# EasyEDA Pro project ProPrj_24v转5v_2024-09-12.epro

# Schematic Schematic1
Board Name: Board1; Create Date: 2024-09-04
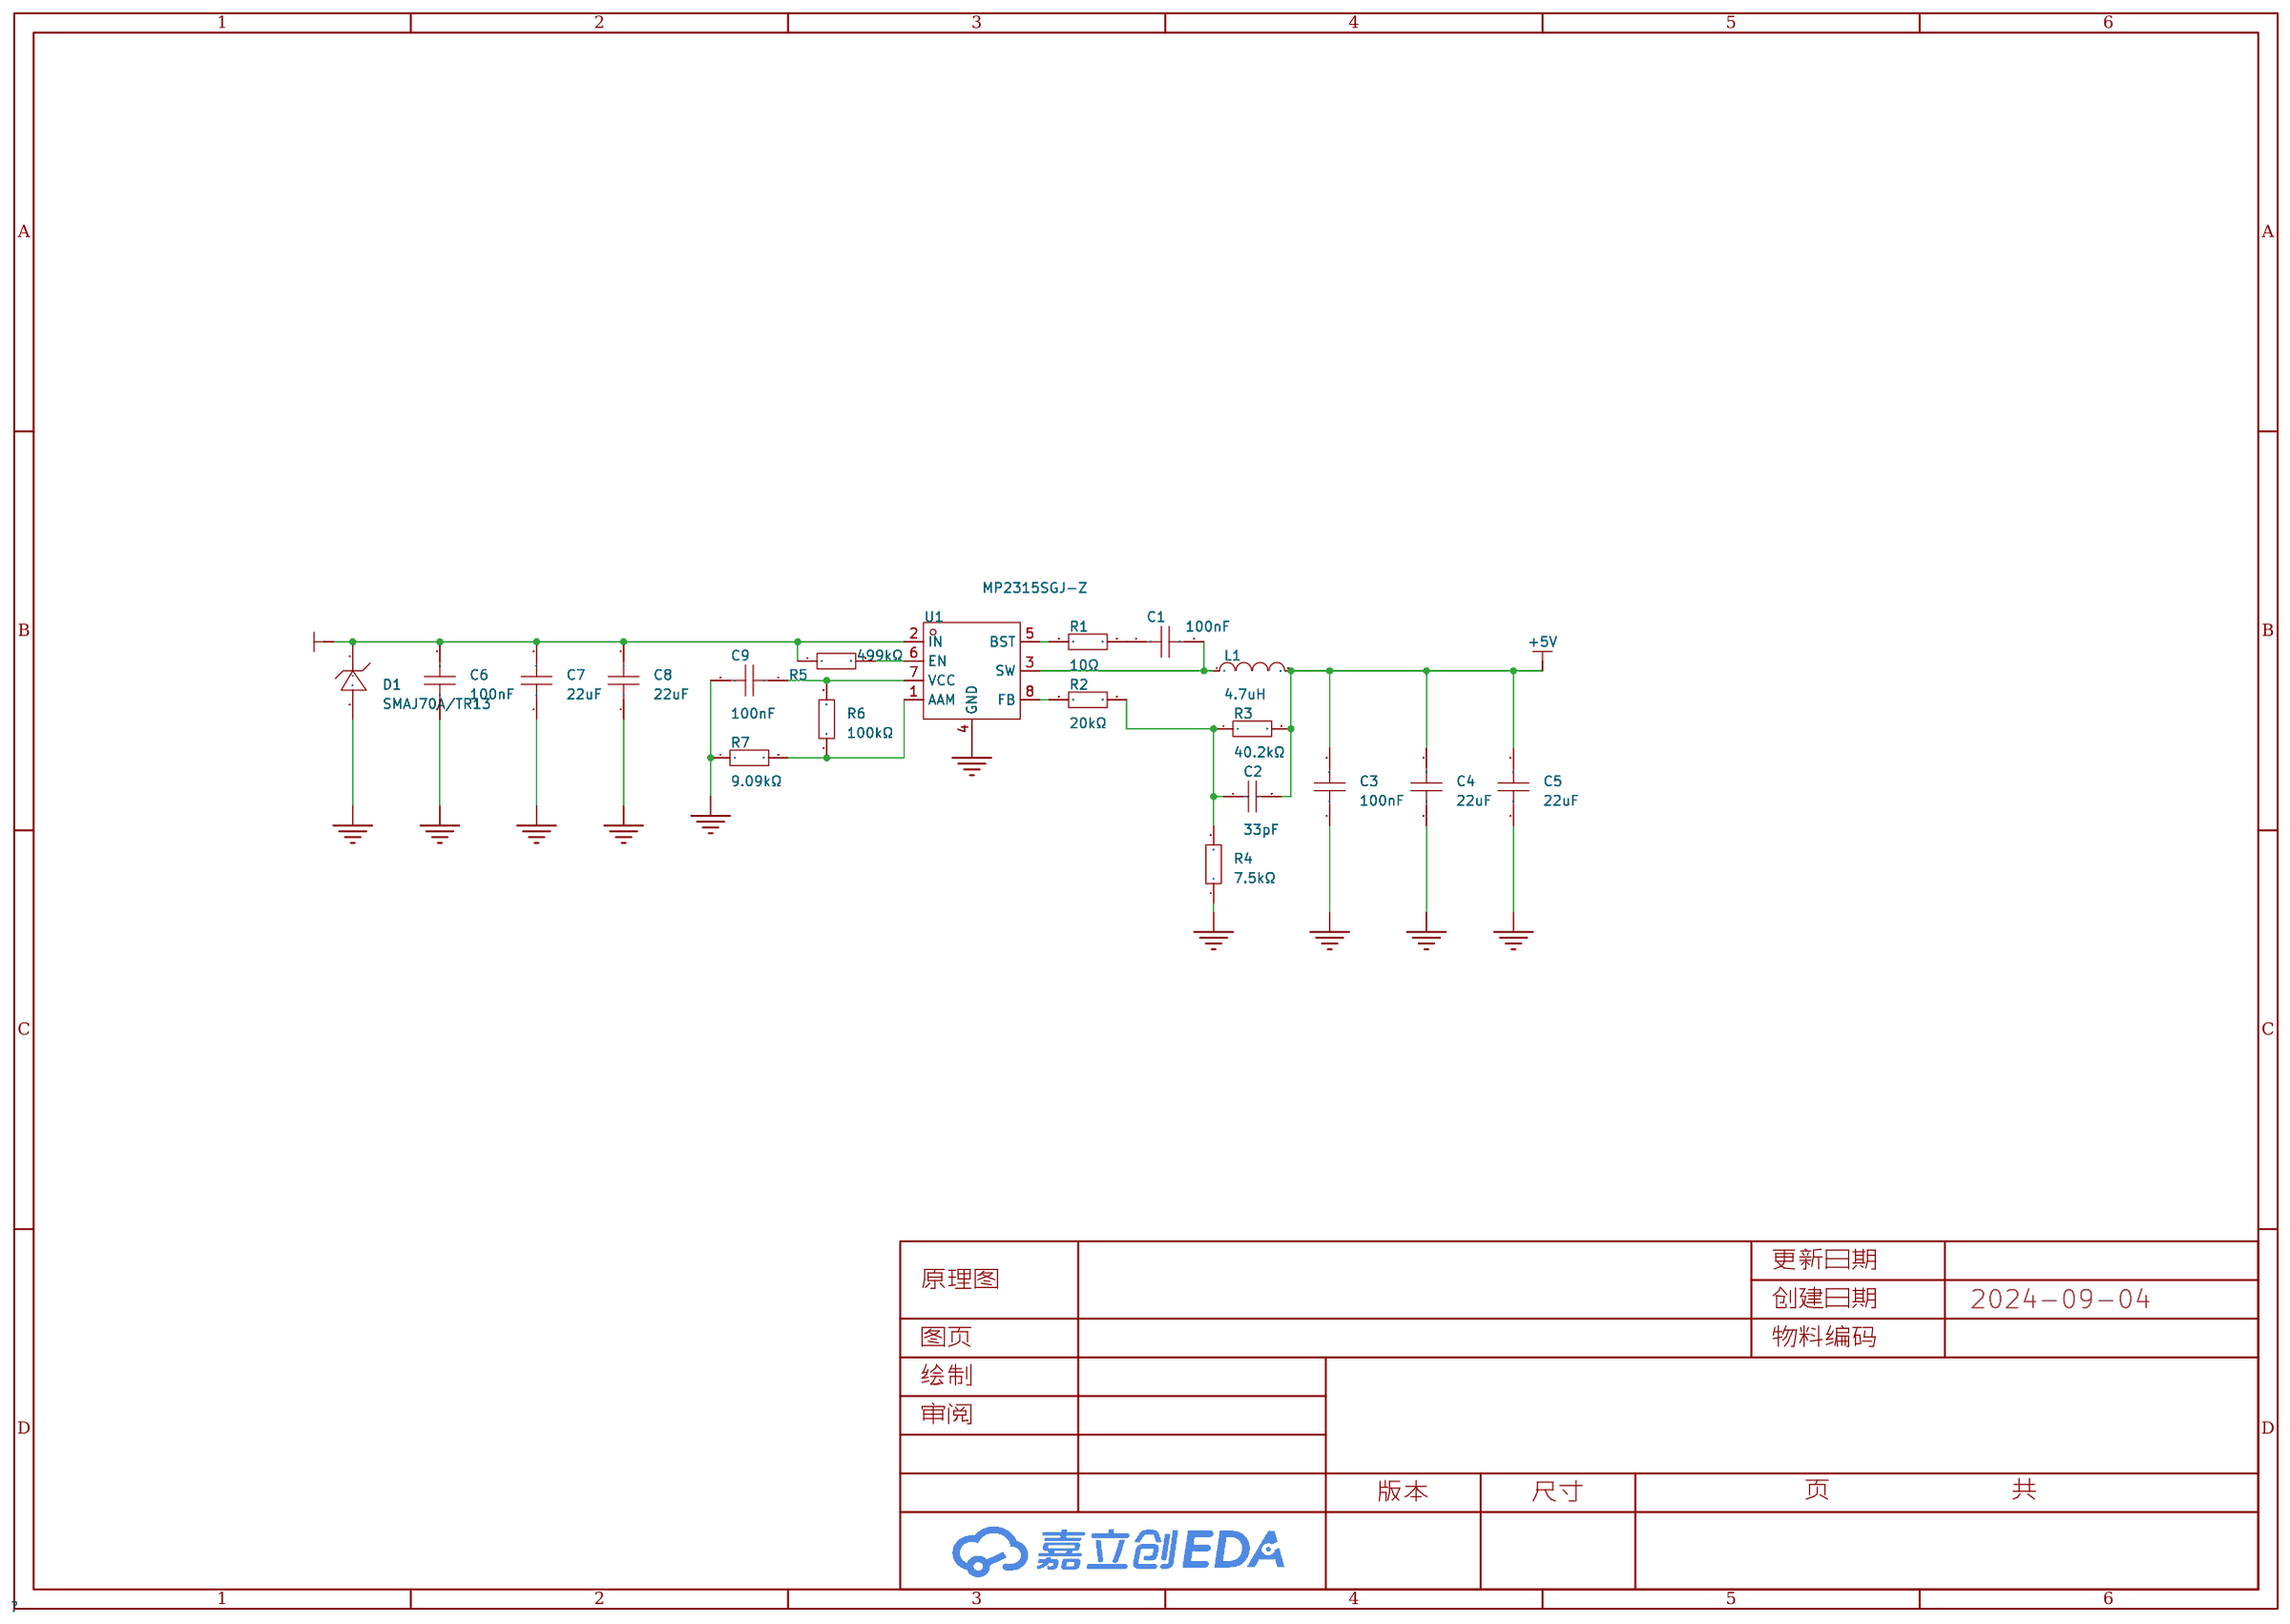
[diagram p0: schematic sheet]

## Parts
C1  100nF  [C0603]
C2  33pF  [C0603]
C3  100nF  [C0603]
C4  22uF  [C0603]
C5  22uF  [C0603]
C6  100nF  [C0603]
C7  22uF  [C0603]
C8  22uF  [C0603]
C9  100nF  [C0603]
D1  SMAJ70A/TR13  [SMA_L4.3-W2.6-LS5.1-RD]
L1  4.7uH  [IND-SMD_L5.4-W5.2_FXL0530]
R1  10Ω  [R0603]
R2  20kΩ  [R0603]
R3  40.2kΩ  [R0603]
R4  7.5kΩ  [R0603]
R5  499kΩ  [R0603]
R6  100kΩ  [R0603]
R7  9.09kΩ  [R0603]
U1  MP2315SGJ-Z  [TSOT-23-8_L2.9-W1.6-P0.65-LS2.8-BL]

## Library data of the parts
C1 C3 C6 C9 = CGA0603X7R104K500JT: 容值:100nF;精度:±10%;额定电压:50V;材质(温度系数):X7R;; LCSC Part Name: 100nF ±10% 50V; Supplier Part: C6119867; Manufacturer: HRE(芯声); Supplier Footprint: 0603; JLCPCB Part Class: 扩展库; Supplier: LCSC; Tolerance: ±10%; Voltage Rated: 50V; Temperature Coefficient: X7R
C2 = CL10C330JB8NNNC: 容值:33pF;精度:±5%;额定电压:50V;材质(温度系数):C0G;; LCSC Part Name: 33pF ±5% 50V; Supplier Part: C1663; Manufacturer: SAMSUNG(三星); Supplier Footprint: 0603; JLCPCB Part Class: 基础库; Datasheet: https://atta.szlcsc.com/upload/public/pdf/source/20160218/1457707763339.pdf; Supplier: LCSC; Tolerance: ±5%; Voltage Rated: 50V; Temperature Coefficient: C0G
C4 C5 C7 C8 = CGA0603X5R226M160JT: 容值:22uF;精度:±20%;额定电压:16V;材质(温度系数):X5R;; LCSC Part Name: 22uF ±20% 16V; Supplier Part: C6119868; Manufacturer: HRE(芯声); Supplier Footprint: 0603; JLCPCB Part Class: 扩展库; Supplier: LCSC; Tolerance: ±20%; Voltage Rated: 16V; Temperature Coefficient: X5R
D1 = SMAJ70A/TR13: 反向截止电压(Vrwm):70V;最大钳位电压:113V;峰值脉冲电流(Ipp)@10/1000us:3.5A;峰值脉冲功率(Ppp)@10/1000us:400W;击穿电压:77.8V;; LCSC Part Name: 单向TVS 70V截止 3.5A峰值脉冲; Supplier Part: C309908; Manufacturer: Brightking(君耀电子); Supplier Footprint: SMA(DO-214AC); JLCPCB Part Class: 扩展库; Datasheet: https://atta.szlcsc.com/upload/public/pdf/source/20181228/C309923_5050AAC339BD333075499EF9AB8D64AD.pdf; Supplier: LCSC; Reverse Stand-Off Voltage (Vrwm): 70V; Maximum Clamping Voltage: 113V; Peak Pulse Current (Ipp)@10/1000us: 3.5A; Peak Pulse Power Dissipation (Ppp)@10/1000us: 400W; Breakdown Voltage: 77.8V; Type: TVS
L1 = FXL0530-4R7-M: 电感值:4.7uH;精度:±20%;额定电流:4.5A;饱和电流(Isat):5A;类型:一体成型电感;; LCSC Part Name: 4.7uH ±20% 5A; Supplier Part: C177246; Manufacturer: cjiang(长江微电); Supplier Footprint: SMD,5.2x5.4mm; JLCPCB Part Class: 扩展库; Datasheet: https://atta.szlcsc.com/upload/public/pdf/source/20240426/3189EA8206330E2108542F9E34E540E7.pdf; Supplier: LCSC; Tolerance: ±20%; Rated Current: 4.5A; Saturation Current (Isat): 5A; DC Resistance (DCR): 60mΩ; Type: 一体成型电感
R1 = 0603WAF100JT5E: 电阻类型:厚膜电阻;阻值:10Ω;精度:±1%;功率:100mW;最大工作电压:75V;温度系数:±400ppm/℃;; LCSC Part Name: 10Ω ±1% 100mW 厚膜电阻; Supplier Part: C22859; Manufacturer: UNI-ROYAL(厚声); Supplier Footprint: 0603; JLCPCB Part Class: 基础库; Datasheet: https://atta.szlcsc.com/upload/public/pdf/source/20200306/C422600_1E6D84923E4A46A82E41ADD87F860B5C.pdf; Supplier: LCSC; Type: 厚膜电阻; Tolerance: ±1%; Power(Watts): 100mW; Overload Voltage (Max): 75V; Temperature Coefficient: ±400ppm/℃; Operating Temperature Range: -55℃~+155℃
R2 = 0603WAF2002T5E: 电阻类型:厚膜电阻;阻值:20kΩ;精度:±1%;功率:100mW;最大工作电压:75V;温度系数:±100ppm/℃;; LCSC Part Name: 20kΩ ±1% 100mW 厚膜电阻; Supplier Part: C4184; Manufacturer: UNI-ROYAL(厚声); Supplier Footprint: 0603; JLCPCB Part Class: 基础库; Datasheet: https://atta.szlcsc.com/upload/public/pdf/source/20200306/C422600_1E6D84923E4A46A82E41ADD87F860B5C.pdf; Supplier: LCSC; Type: 厚膜电阻; Tolerance: ±1%; Power(Watts): 100mW; Overload Voltage (Max): 75V; Temperature Coefficient: ±100ppm/℃; Operating Temperature Range: -55℃~+155℃
R3 = 0603WAF4022T5E: 电阻类型:厚膜电阻;阻值:40.2kΩ;精度:±1%;功率:100mW;最大工作电压:75V;温度系数:±100ppm/℃;; LCSC Part Name: 40.2kΩ ±1% 100mW 厚膜电阻; Supplier Part: C12447; Manufacturer: UNI-ROYAL(厚声); Supplier Footprint: 0603; JLCPCB Part Class: 扩展库; Datasheet: https://atta.szlcsc.com/upload/public/pdf/source/20200306/C422600_1E6D84923E4A46A82E41ADD87F860B5C.pdf; Supplier: LCSC; Type: 厚膜电阻; Tolerance: ±1%; Power(Watts): 100mW; Overload Voltage (Max): 75V; Temperature Coefficient: ±100ppm/℃; Operating Temperature Range: -55℃~+155℃
R4 = 0603WAF7501T5E: 电阻类型:厚膜电阻;阻值:7.5kΩ;精度:±1%;功率:100mW;最大工作电压:75V;温度系数:±100ppm/℃;; LCSC Part Name: 7.5kΩ ±1% 100mW 厚膜电阻; Supplier Part: C23234; Manufacturer: UNI-ROYAL(厚声); Supplier Footprint: 0603; JLCPCB Part Class: 基础库; Datasheet: https://atta.szlcsc.com/upload/public/pdf/source/20200306/C422600_1E6D84923E4A46A82E41ADD87F860B5C.pdf; Supplier: LCSC; Type: 厚膜电阻; Tolerance: ±1%; Power(Watts): 100mW; Overload Voltage (Max): 75V; Temperature Coefficient: ±100ppm/℃; Operating Temperature Range: -55℃~+155℃
R5 = 0603WAF4993T5E: 电阻类型:厚膜电阻;阻值:499kΩ;精度:±1%;功率:100mW;最大工作电压:75V;温度系数:±100ppm/℃;; LCSC Part Name: 499kΩ ±1% 100mW 厚膜电阻; Supplier Part: C26751; Manufacturer: UNI-ROYAL(厚声); Supplier Footprint: 0603; JLCPCB Part Class: 扩展库; Datasheet: https://atta.szlcsc.com/upload/public/pdf/source/20200306/C422600_1E6D84923E4A46A82E41ADD87F860B5C.pdf; Supplier: LCSC; Type: 厚膜电阻; Tolerance: ±1%; Power(Watts): 100mW; Overload Voltage (Max): 75V; Temperature Coefficient: ±100ppm/℃; Operating Temperature Range: -55℃~+155℃
R6 = RC0603FR-07100KL: 电阻类型:厚膜电阻;阻值:100kΩ;精度:±1%;功率:100mW;最大工作电压:75V;温度系数:±100ppm/℃;; LCSC Part Name: 厚膜电阻 100kΩ ±1% 100mW; Supplier Part: C14675; Manufacturer: YAGEO(国巨); Supplier Footprint: 0603; JLCPCB Part Class: 扩展库; Datasheet: https://atta.szlcsc.com/upload/public/pdf/source/20140324/1457707028752.pdf; Supplier: LCSC; Type: 厚膜电阻; Tolerance: ±1%; Power(Watts): 100mW; Overload Voltage (Max): 75V; Temperature Coefficient: ±100ppm/℃; Operating Temperature Range: -55℃~+155℃
R7 = 0603WAF9091T5E: 电阻类型:厚膜电阻;阻值:9.09kΩ;精度:±1%;功率:100mW;最大工作电压:75V;温度系数:±100ppm/℃;; LCSC Part Name: 9.09kΩ ±1% 100mW 厚膜电阻; Supplier Part: C23125; Manufacturer: UNI-ROYAL(厚声); Supplier Footprint: 0603; JLCPCB Part Class: 扩展库; Datasheet: https://atta.szlcsc.com/upload/public/pdf/source/20200306/C422600_1E6D84923E4A46A82E41ADD87F860B5C.pdf; Supplier: LCSC; Type: 厚膜电阻; Tolerance: ±1%; Power(Watts): 100mW; Overload Voltage (Max): 75V; Temperature Coefficient: ±100ppm/℃; Operating Temperature Range: -55℃~+155℃
U1 = MP2315SGJ-Z: 功能类型:降压型;输出类型:可调;输入电压:4.5V~24V;输出电压:800mV~22.8V;输出电流:3A;; Supplier Part: C3031493; Manufacturer: MPS(芯源); Supplier Footprint: TSOT-23-8; JLCPCB Part Class: 扩展库; Supplier: LCSC; Function: 降压型; Output Type: 可调; Input Voltage: 4.5V~24V; Output Voltage: 800mV~22.8V; Output Current: 3A; Switching Frequency: 500kHz; Operating Temperature: -40℃~+125℃@(TJ); Synchronous Rectification: 是; Number of Outputs: 1; Topology: 降压式; Switch tube (built-in/external): 内置

## Nets
24V: C6.2 C7.2 C8.2 D1.1 R5.1 U1.2(IN)
+5V: C2.2 C3.2 C4.2 C5.2 L1.2 R3.2
GND: C3.1 C4.1 C5.1 C6.1 C7.1 C8.1 C9.2 D1.2 R4.1 R7.1 U1.4(GND)
$1N234: R1.1 U1.5(BST)
$1N313: C1.2 L1.1 U1.3(SW)
$1N323: C1.1 R1.2
$1N469: R2.1 U1.8(FB)
$1N854: C2.1 R2.2 R3.1 R4.2
$1N2140: R5.2 U1.6(EN)
$1N2191: C9.1 R6.2 U1.7(VCC)
$1N2220: R6.1 R7.2 U1.1(AAM)

# Board PCB1
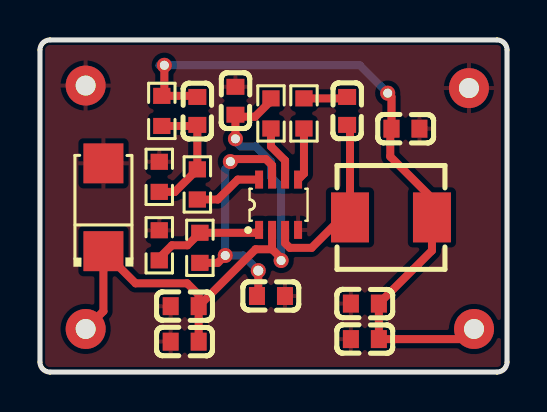
[diagram p1: board, top side]
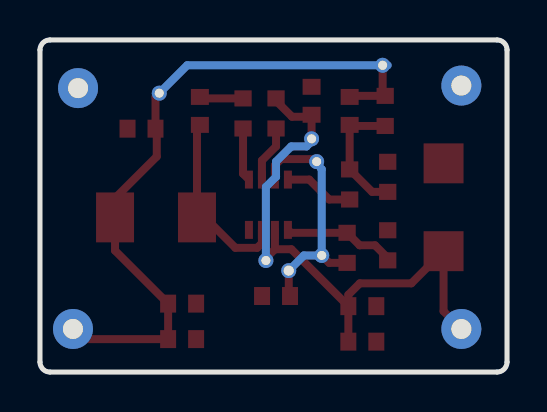
[diagram p2: board, bottom side, seen from below]

Outline 23.37 x 16.64 mm; copper layers: Top Layer, Bottom Layer. Coordinates in mm from the lower left corner of the outline.
Outline path: 0,16.14 0,0.5 arc(0.15,0.15) 0.5,0 22.87,0 arc(23.22,0.15) 23.37,0.5 23.37,16.14 arc(23.22,16.49) 22.87,16.64 0.5,16.64 arc(0.15,16.49) 0,16.14
Stack: Top Layer 0.035mm / Dielectric1 1.51mm FR4 er 4.5 / Bottom Layer 0.035mm

## Design rules (mm)
template: JLCPCB Capability(Two Layers Board)
spacing copperThickness1oz (default): track to track 0.102, other pairs 0.152 to 0.3
spacing copperThickness2oz: track to track 0.203, other pairs 0.152 to 0.3
track width copperThickness1oz (default): min 0.127, default 0.254, max 2.54
track width copperThickness2oz: min 0.203, default 0.254, max 2.54
differential pair differentialPair (default): width min 0.127, default 0.254, max 2.54; gap min 0.152, default 0.152
via viaSize (default): diameter min 0.5, default 0.61, max 10; hole min 0.3, default 0.305, max 6.3

## Placement (name value [footprint] x y rotation side)
C1  100nF  [C0603]  15.37 13.08 270 top
C2  33pF  [C0603]  7.87 13.08 90 top
C3  100nF  [C0603]  18.29 12.19 180 top
C4  22uF  [C0603]  16.26 3.43 0 top
C5  22uF  [C0603]  16.26 1.65 0 top
C6  100nF  [C0603]  9.78 13.59 270 top
C7  22uF  [C0603]  7.24 3.3 0 top
C8  22uF  [C0603]  7.24 1.52 0 top
C9  100nF  [C0603]  11.56 3.81 0 top
D1  SMAJ70A/TR13  [SMA_L4.3-W2.6-LS5.1-RD]  3.18 8.26 90 top
L1  4.7uH  [IND-SMD_L5.4-W5.2_FXL0530]  17.56 7.75 0 top
NOREF  -  [Pad_e341]  9.27 5.84 0 top
NOREF#2  -  [Pad_e364]  12.06 5.59 0 top
NOREF#3  -  [Pad_e360]  9.78 11.68 0 top
NOREF#4  -  [Pad_e378]  9.53 10.54 0 top
NOREF#5  -  [Pad_e345]  10.92 5.08 0 top
NOREF#6  -  [Pad_e1046]  17.4 13.97 0 top
NOREF#7  -  [Pad_e850]  21.72 2.16 0 top
NOREF#8  -  [Pad_e849]  2.29 2.16 0 top
NOREF#9  -  [Pad_e716]  21.46 14.22 0 top
NOREF#10  -  [Pad_e1047]  6.22 15.37 0 top
NOREF#11  -  [Pad_e580]  2.29 14.35 0 top
R1  10Ω  [R0603]  13.21 12.95 90 top
R2  20kΩ  [R0603]  7.87 9.4 90 top
R3  40.2kΩ  [R0603]  6.1 13.08 90 top
R4  7.5kΩ  [R0603]  5.97 9.78 270 top
R5  499kΩ  [R0603]  11.56 12.95 270 top
R6  100kΩ  [R0603]  8 6.22 270 top
R7  9.09kΩ  [R0603]  5.97 6.35 270 top
U1  MP2315SGJ-Z  [TSOT-23-8_L2.9-W1.6-P0.65-LS2.8-BL]  11.94 8.38 0 top

## Footprints (pads in the part's own frame, mm; a bottom-side part is the same pattern mirrored in y, then rotated)
C0603
  rect 0.8x0.9 smd: 1(-0.7,0) 2(0.7,0)
IND-SMD_L5.4-W5.2_FXL0530
  rect 1.9x2.5 smd: 1(-2.05,0) 2(2.05,0)
Pad_e341
  round 0.75 hole 0.45: 1(0,0)
Pad_e345
  round 0.75 hole 0.5: 1(0,0)
Pad_e360
  round 0.75 hole 0.45: 1(0,0)
Pad_e364
  round 0.75 hole 0.45: 1(0,0)
Pad_e378
  round 0.75 hole 0.45: 1(0,0)
Pad_e580
  round 2 hole 1: 1(0,0)
Pad_e716
  round 2 hole 1: 1(0,0)
Pad_e849
  round 2 hole 1: 1(0,0)
Pad_e850
  round 2 hole 1: 2(0,0)
Pad_e1046
  round 0.75 hole 0.45: 1(0,0)
Pad_e1047
  round 0.75 hole 0.45: 1(0,0)
R0603
  rect 0.806x0.864 smd: 1(-0.753,0) 2(0.753,0)
SMA_L4.3-W2.6-LS5.1-RD
  rect 2x2 smd: 1(-2.2,0) 2(2.2,0)
TSOT-23-8_L2.9-W1.6-P0.65-LS2.8-BL
  rect 0.4x0.9 smd: 1(-0.975,-1.26) 2(-0.325,-1.26) 3(0.325,-1.26) 4(0.975,-1.26) 5(0.975,1.26) 6(0.325,1.26) 7(-0.325,1.26) 8(-0.975,1.26)

## Nets
24V: C6.2 C7.2 C8.2 D1.1 NOREF#2.1 NOREF#3.1 NOREF#8.1 R5.1 U1.2
+5V: C2.2 C3.2 C4.2 C5.2 L1.2 NOREF#6.1 NOREF#7.2 NOREF#10.1 R3.2
GND: C3.1 C4.1 C5.1 C6.1 C7.1 C8.1 C9.2 D1.2 NOREF#9.1 NOREF#11.1 R4.1 R7.1 U1.4
$1N234: R1.1 U1.5
$1N313: C1.2 L1.1 U1.3
$1N323: C1.1 R1.2
$1N469: R2.1 U1.8
$1N854: C2.1 R2.2 R3.1 R4.2
$1N2140: R5.2 U1.6
$1N2191: C9.1 NOREF.1 NOREF#4.1 NOREF#5.1 R6.2 U1.7
$1N2220: R6.1 R7.2 U1.1

## Routing (per net, layer and track width the routed paths; a pad name or vN(x,y) marks a point on that pad's centre or on a via; arc(x,y) is an arc through that point)
24V: length 29.7
  Top Layer w0.4: NOREF#8.1 3.18,3.05 D1.1 4.78,4.45 7.37,4.45 7.94,3.87 C7.2 ; C8.2 C7.2 ; C7.2 10.79,6.15 11.61,6.15 ; 9.78,11.56 9.78,12.79 10.76,12.79 11.56,13.59 R5.1 ; 11.61,6.15 U1.2 ; 11.61,6.15 12.06,5.7 NOREF#2.1
  Bottom Layer w0.4: 9.78,11.56 10.03,11.3 10.8,11.3 11.56,10.54 11.56,9.78 12.06,9.27 NOREF#2.1
+5V: length 34.8
  Top Layer w0.4: C2.2 7.82,13.83 R3.2 6.22,13.96 NOREF#10.1 ; NOREF#7.2 21.21,1.65 C5.2 C4.2 19.61,6.09 L1.2 19.61,8.71 17.53,10.8 17.53,12.13 C3.2 17.59,13.78 NOREF#6.1
  Bottom Layer w0.4: NOREF#6.1 16,15.37 5.97,15.37
$1N234: length 2.7
  Top Layer w0.4: R1.1 13.21,9.94 U1.5
$1N313: length 9.3
  Top Layer w0.4: U1.3 12.26,6.46 12.5,6.22 13.59,6.22 15.11,7.75 L1.1 15.51,12.24 C1.2
$1N323: length 2.2
  Top Layer w0.4: R1.2 15.29,13.71 C1.1
$1N469: length 3.5
  Top Layer w0.4: R2.1 8.9,8.64 9.9,9.64 10.96,9.64
$1N854: length 6.4
  Top Layer w0.4: R3.1 7.82,12.33 C2.1 R2.2 6.75,9.03 R4.2
$1N2140: length 2.9
  Top Layer w0.4: U1.6 12.26,10.6 11.56,11.3 R5.2
$1N2191: length 11.9
  Top Layer w0.4: 9.65,10.67 11.3,10.67 11.61,10.36 U1.7 ; R6.2 8.9,5.47 NOREF.1 ; NOREF#5.1 10.92,3.88 C9.1
  Bottom Layer w0.4: NOREF#5.1 10.16,5.84 NOREF.1 9.27,10.16 9.31,10.2
$1N2220: length 5.7
  Top Layer w0.4: R7.2 5.97,5.72 6.6,6.35 7.37,6.35 R6.1 10.82,6.98 10.96,7.12

## Copper pours and planes (outline as drawn; the poured copper is in the pictures)
GND on Top Layer: 0.15,16.49 23.06,16.49 23.06,0.18 0.15,0.18
